# EAGLE schematic Input (EAGLE 6.4)
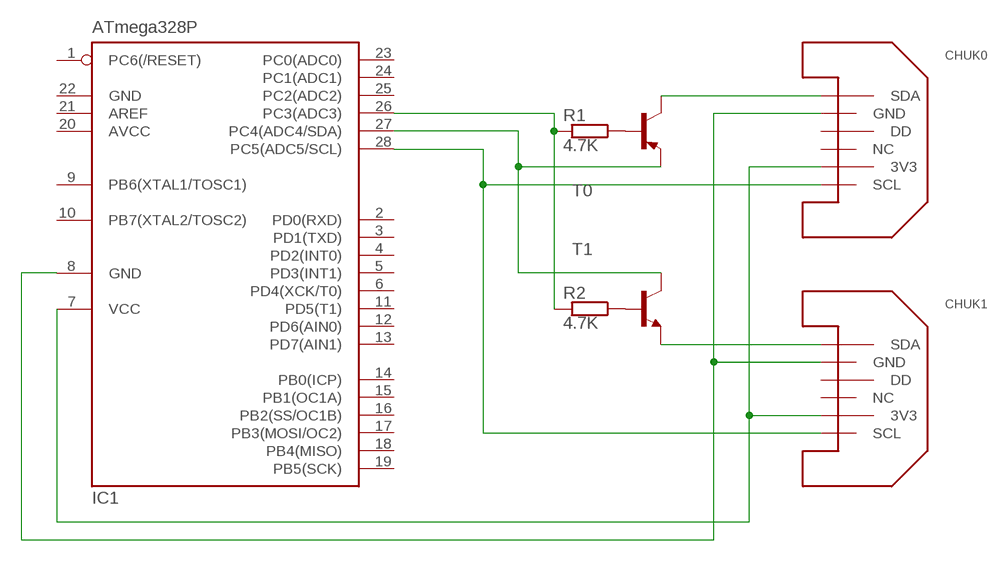
[diagram p0: schematic, sheet 1]

## Parts
CHUK0  WII-NUNCHUK  [WII-NUNCHUK]
CHUK1  WII-NUNCHUK  [WII-NUNCHUK]
IC1  ATmega328P  MEGA8-P  [DIL28-3]
R1  4.7K  BVS  [BVS]
R2  4.7K  BVS  [BVS]
T0  -PNP-SOT23-BCE  [SOT23-BCE]
T1  -NPN-SOT23-EBC  [SOT23-EBC]

## Nets
N$1: R1.1 T0.B
N$2: R2.1 T1.B
N$3: IC1.27(PC4(ADC4/SDA)) T0.E T1.C
N$4: IC1.26(PC3(ADC3)) R1.2 R2.2
N$5: CHUK0.SDA T0.C
N$6: CHUK1.SDA T1.E
N$7: CHUK0.SCL CHUK1.SCL IC1.28(PC5(ADC5/SCL))
N$8: CHUK0.GND CHUK1.GND IC1.8(GND)
N$9: CHUK0.3V3 CHUK1.3V3 IC1.7(VCC)
Unconnected: CHUK0.DD CHUK0.NC CHUK1.DD CHUK1.NC IC1.1(PC6(/RESET)) IC1.2(PD0(RXD)) IC1.3(PD1(TXD)) IC1.4(PD2(INT0)) IC1.5(PD3(INT1)) IC1.6(PD4(XCK/T0)) IC1.9(PB6(XTAL1/TOSC1)) IC1.10(PB7(XTAL2/TOSC2)) IC1.11(PD5(T1)) IC1.12(PD6(AIN0)) IC1.13(PD7(AIN1)) IC1.14(PB0(ICP)) IC1.15(PB1(OC1A)) IC1.16(PB2(SS/OC1B)) IC1.17(PB3(MOSI/OC2)) IC1.18(PB4(MISO)) IC1.19(PB5(SCK)) IC1.21(AREF) IC1.23(PC0(ADC0)) IC1.24(PC1(ADC1)) IC1.25(PC2(ADC2))

## Power pins joined to a net without a drawn wire
AVCC: IC1.20(AVCC)
GND: IC1.22(GND)

## Library data of the parts
CHUK0 CHUK1 = WiiChuk:WII-NUNCHUK: Wii Nunchuk
IC1 = atmel:MEGA8-P: MICROCONTROLLER 8 Kbytes FLASH, 1 kbytes SRAM, 512 bytes EEPROM, USART, 4-channel 10 bit ADC, 2-channel 8 bit ADC Pin compatible with Atmega48, ATMega88, ATMega168 Source: avr.lbr; OC_FARNELL: unknown; OC_NEWARK: unknown
R1 R2 = resistor-shunt:BVS: SMD SHUNT RESISTOR; OC_FARNELL: unknown; OC_NEWARK: unknown
T0 = transistor:*-PNP-: PNP Transistror
T1 = transistor:*-NPN-: NPN Transistror BF959 corrected 2008.03.06